# EAGLE design controller_rev4.2b (EAGLE 9.3.0)

## Sheet 1 of 3: Controller
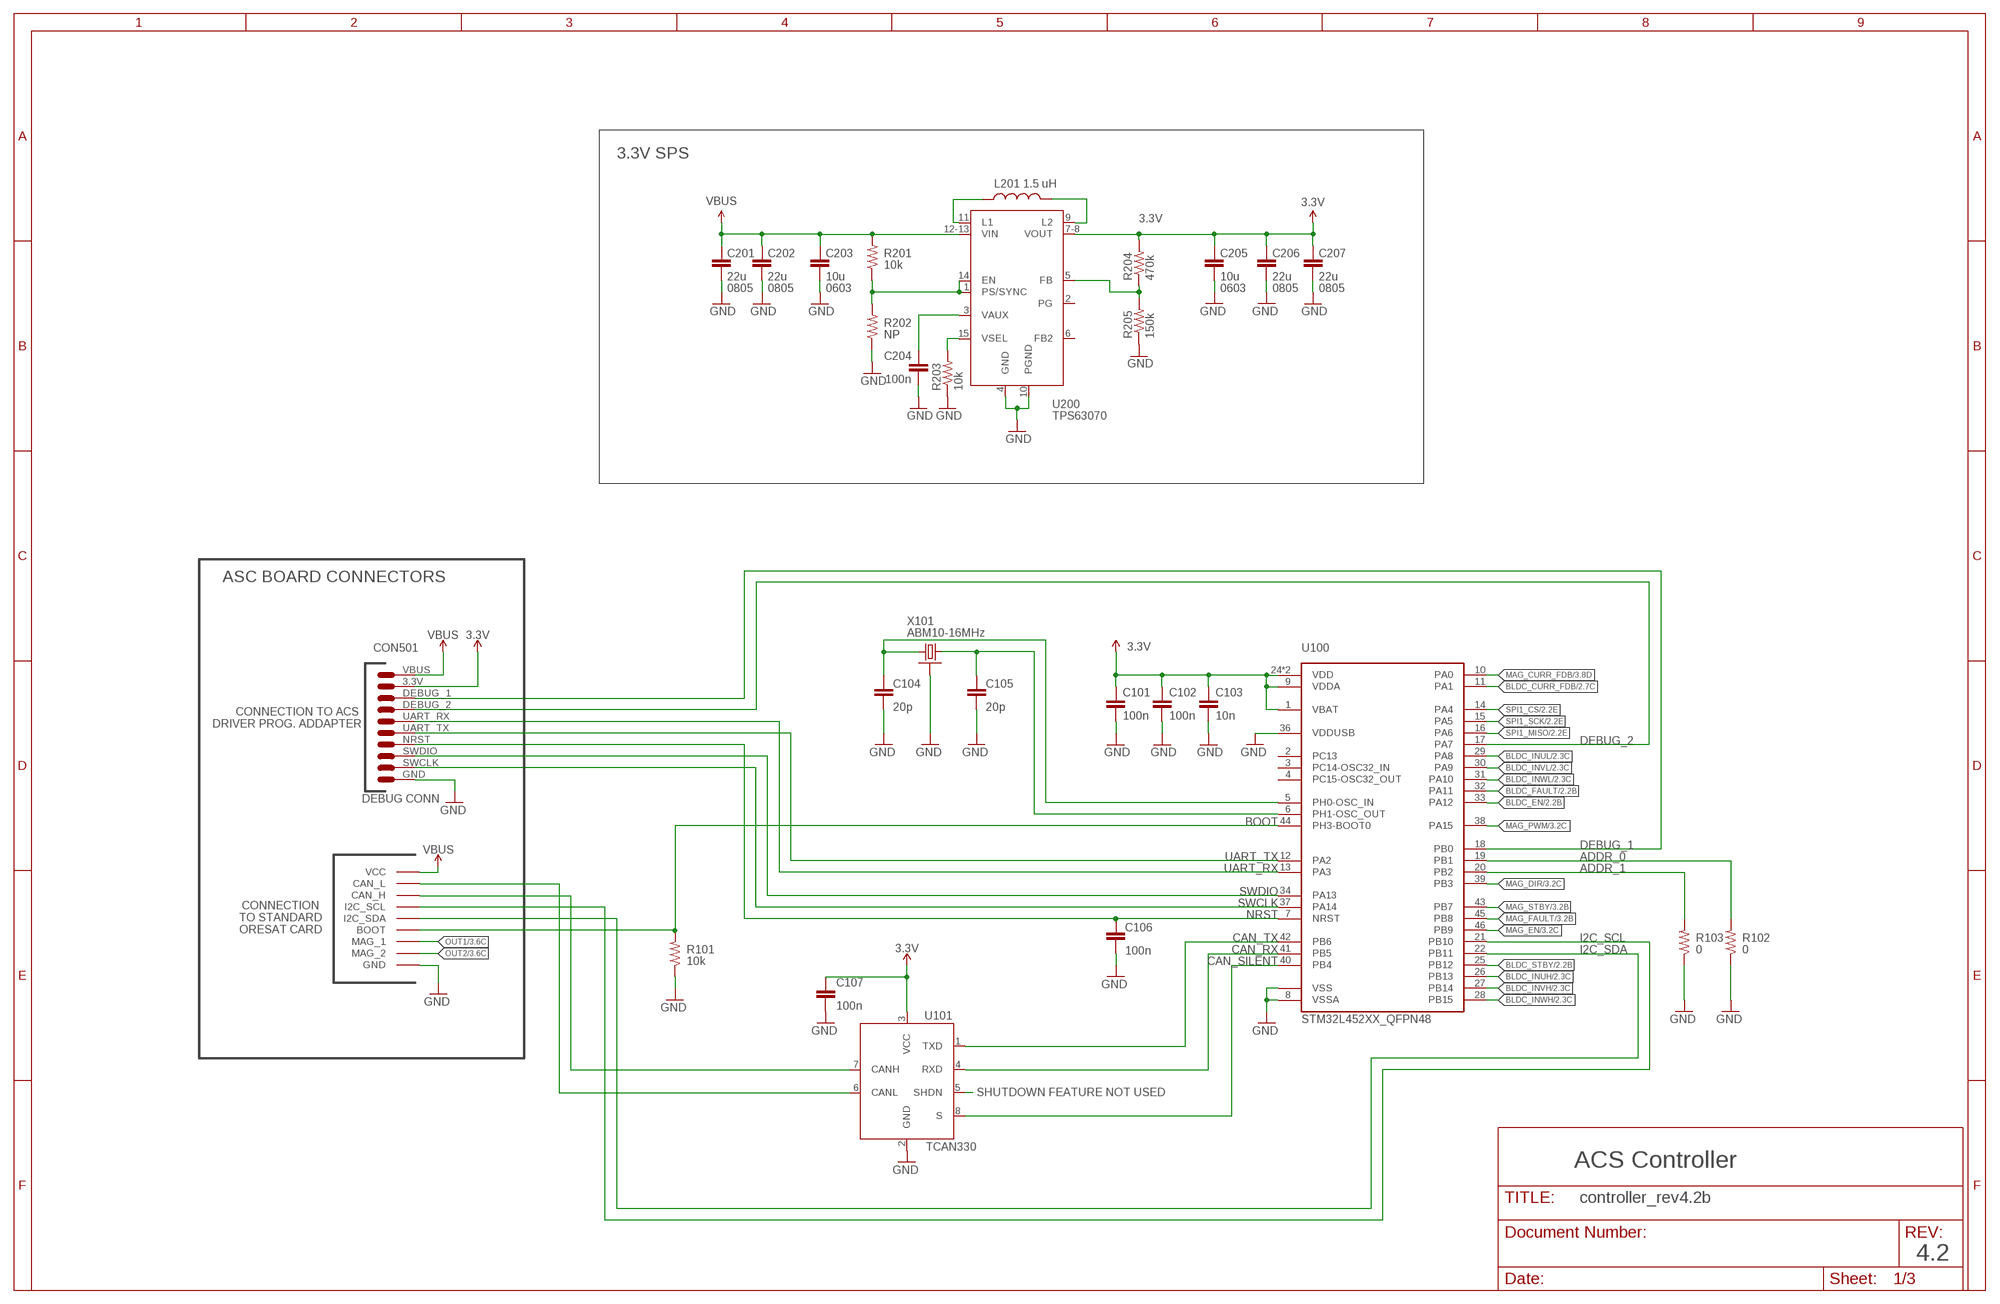
[diagram p0: schematic, sheet 1]

### Parts
C101  100n  C-EU0402-B-NOSILK  [.0402-B-NOSILK]
C102  100n  C-EU0402-B-NOSILK  [.0402-B-NOSILK]
C103  10n  C-EU0402-B-NOSILK  [.0402-B-NOSILK]
C104  20p  C-EU0402-B-NOSILK  [.0402-B-NOSILK]
C105  20p  C-EU0402-B-NOSILK  [.0402-B-NOSILK]
C106  100n  C-EU0402-B-NOSILK  [.0402-B-NOSILK]
C107  100n  C-EU0402-B-NOSILK  [.0402-B-NOSILK]
C201  22u  C-EU0805-B-NOSILK  [.0805-B-NOSILK]
C202  22u  C-EU0805-B-NOSILK  [.0805-B-NOSILK]
C203  10u  C-EU0603-B-NOSILK  [.0603-B-NOSILK]
C204  100n  C-EU0402-B-NOSILK  [.0402-B-NOSILK]
C205  10u  C-EU0603-B-NOSILK  [.0603-B-NOSILK]
C206  22u  C-EU0805-B-NOSILK  [.0805-B-NOSILK]
C207  22u  C-EU0805-B-NOSILK  [.0805-B-NOSILK]
C501  DEBUG_CON  [DEBUG_CON]
L201  1.5 uH  L-COILCRAFT-XFL4020  [L-COILCRAFT-XFL4020]
R101  10k  R-US_0402-B-NOSILK  [.0402-B-NOSILK]
R102  0  R-US_0402-B-NOSILK  [.0402-B-NOSILK]
R103  0  R-US_0402-B-NOSILK  [.0402-B-NOSILK]
R201  10k  R-US_0402-B-NOSILK  [.0402-B-NOSILK]
R202  NP  R-US_0402-B-NOSILK  [.0402-B-NOSILK]
R203  10k  R-US_0402-B-NOSILK  [.0402-B-NOSILK]
R204  470k  R-US_0402-B-NOSILK  [.0402-B-NOSILK]
R205  150k  R-US_0402-B-NOSILK  [.0402-B-NOSILK]
U100  STM32L452XX_QFPN48  [QFPN-48]
U101  TCAN330  [SOT23-8_TI-DCN]
U200  TPS63070  TPS63070X  [TPS63070X]
U$2  MEZZANINE_1  [MEZZANINE_1]
X101  ABM10-16MHz  CRYSTAL-WITH-GND  [CRYSTAL_2.5X2]

### Nets
3.3V: C101.1 C102.1 C103.1 C107.1 C205.1 C206.1 C207.1 C501.3.3V R204.2 U100.1(VBAT) U100.9(VDDA) U100.24(VDD) U100.48(VDD) U101.3(VCC) U200.7-8(VOUT) ; also sheet 2,3
ADDR_0: R102.2 U100.19(PB1)
ADDR_1: R103.2 U100.20(PB2)
BLDC_CURR_FDB: U100.11(PA1) ; also sheet 2
BLDC_EN: U100.33(PA12) ; also sheet 2
BLDC_FAULT: U100.32(PA11) ; also sheet 2
BLDC_INUH: U100.26(PB13) ; also sheet 2
BLDC_INUL: U100.29(PA8) ; also sheet 2
BLDC_INVH: U100.27(PB14) ; also sheet 2
BLDC_INVL: U100.30(PA9) ; also sheet 2
BLDC_INWH: U100.28(PB15) ; also sheet 2
BLDC_INWL: U100.31(PA10) ; also sheet 2
BLDC_STBY: U100.25(PB12) ; also sheet 2
BOOT: R101.2 U100.44(PH3-BOOT0) U$2.P$9(BOOT) U$2.P$22(BOOT)
CAN_H: U101.7(CANH) U$2.P$6(CAN_H) U$2.P$25(CAN_H)
CAN_L: U101.6(CANL) U$2.P$5(CAN_L) U$2.P$26(CAN_L)
CAN_RX: U100.41(PB5) U101.4(RXD)
CAN_SHDN: U101.5(SHDN)
CAN_SILENT: U100.40(PB4) U101.8(S)
CAN_TX: U100.42(PB6) U101.1(TXD)
CLK1: C104.1 U100.5(PH0-OSC_IN) X101.3
CLK2: C105.1 U100.6(PH1-OSC_OUT) X101.1
DEBUG_1: C501.DEBUG_1 U100.18(PB0)
DEBUG_2: C501.DEBUG_2 U100.17(PA7)
GND: C101.2 C102.2 C103.2 C104.2 C105.2 C106.2 C107.2 C201.2 C202.2 C203.2 C204.2 C205.2 C206.2 C207.2 C501.GND R101.1 R102.1 R103.1 R202.1 R203.1 R205.1 U100.8(VSSA) U100.23(VSS) U100.35(VSS) U100.36(VDDUSB) U100.47(VSS) U100.EPAD(VSS) U101.2(GND) U200.4(GND) U200.10(PGND) U$2.P$1(GND) U$2.P$2(GND) U$2.P$14(GND) U$2.P$15(GND) U$2.P$16(GND) U$2.P$17(GND) U$2.P$29(GND) U$2.P$30(GND) X101.2(SHIELD) X101.4(SHIELD) ; also sheet 2,3
I2C_SCL: U100.21(PB10) U$2.P$7(I2C_SCL) U$2.P$24(I2C_SCL)
I2C_SDA: U100.22(PB11) U$2.P$8(I2C_SDA) U$2.P$23(I2C_SDA)
MAG_CURR_FDB: U100.10(PA0) ; also sheet 3
MAG_DIR: U100.39(PB3) ; also sheet 3
MAG_EN: U100.46(PB9) ; also sheet 3
MAG_FAULT: U100.45(PB8) ; also sheet 3
MAG_PWM: U100.38(PA15) ; also sheet 3
MAG_STBY: U100.43(PB7) ; also sheet 3
NRST: C106.1 C501.NRST U100.7(NRST)
OUT1: U$2.P$10(MAG_1) U$2.P$21(MAG_1) ; also sheet 3
OUT2: U$2.P$11(MAG_2) U$2.P$20(MAG_2) ; also sheet 3
SPI1_CS: U100.14(PA4) ; also sheet 2
SPI1_MISO: U100.16(PA6) ; also sheet 2
SPI1_SCK: U100.15(PA5) ; also sheet 2
SWCLK: C501.SWCLK U100.37(PA14)
SWDIO: C501.SWDIO U100.34(PA13)
TPS-EN2: R201.1 R202.2 U200.1(PS/SYNC) U200.14(EN)
TPS-FB2: R204.1 R205.2 U200.5(FB)
TPS-L5: L201.1 U200.11(L1)
TPS-L6: L201.2 U200.9(L2)
TPS-VAUX2: C204.1 U200.3(VAUX)
TPS-VSEL2: R203.2 U200.15(VSEL)
UART_RX: C501.UART_RX U100.13(PA3)
UART_TX: C501.UART_TX U100.12(PA2)
VBUS: C201.1 C202.1 C203.1 C501.VBUS R201.2 U200.12-13(VIN) U$2.P$3(VCC) U$2.P$4(VCC) U$2.P$12(VCC) U$2.P$13(VCC) U$2.P$18(VCC) U$2.P$19(VCC) U$2.P$27(VCC) U$2.P$28(VCC) ; also sheet 2,3
Unconnected: U100.2(PC13) U100.3(PC14-OSC32_IN) U100.4(PC15-OSC32_OUT) U200.2(PG) U200.6(FB2)

### Notes on the sheet
- 3.3V SPS
- 0805 | 0805 | 0603 | 0603 | 0805 | 0805
- ASC BOARD CONNECTORS
- CON501
- CONNECTION TO ACS 
  DRIVER PROG. ADDAPTER
- DEBUG CONN
- CONNECTION 
  TO STANDARD
  ORESAT CARD
- SHUTDOWN FEATURE NOT USED
- ACS Controller
- 4.2

## Sheet 2 of 3: Reaction Wheel
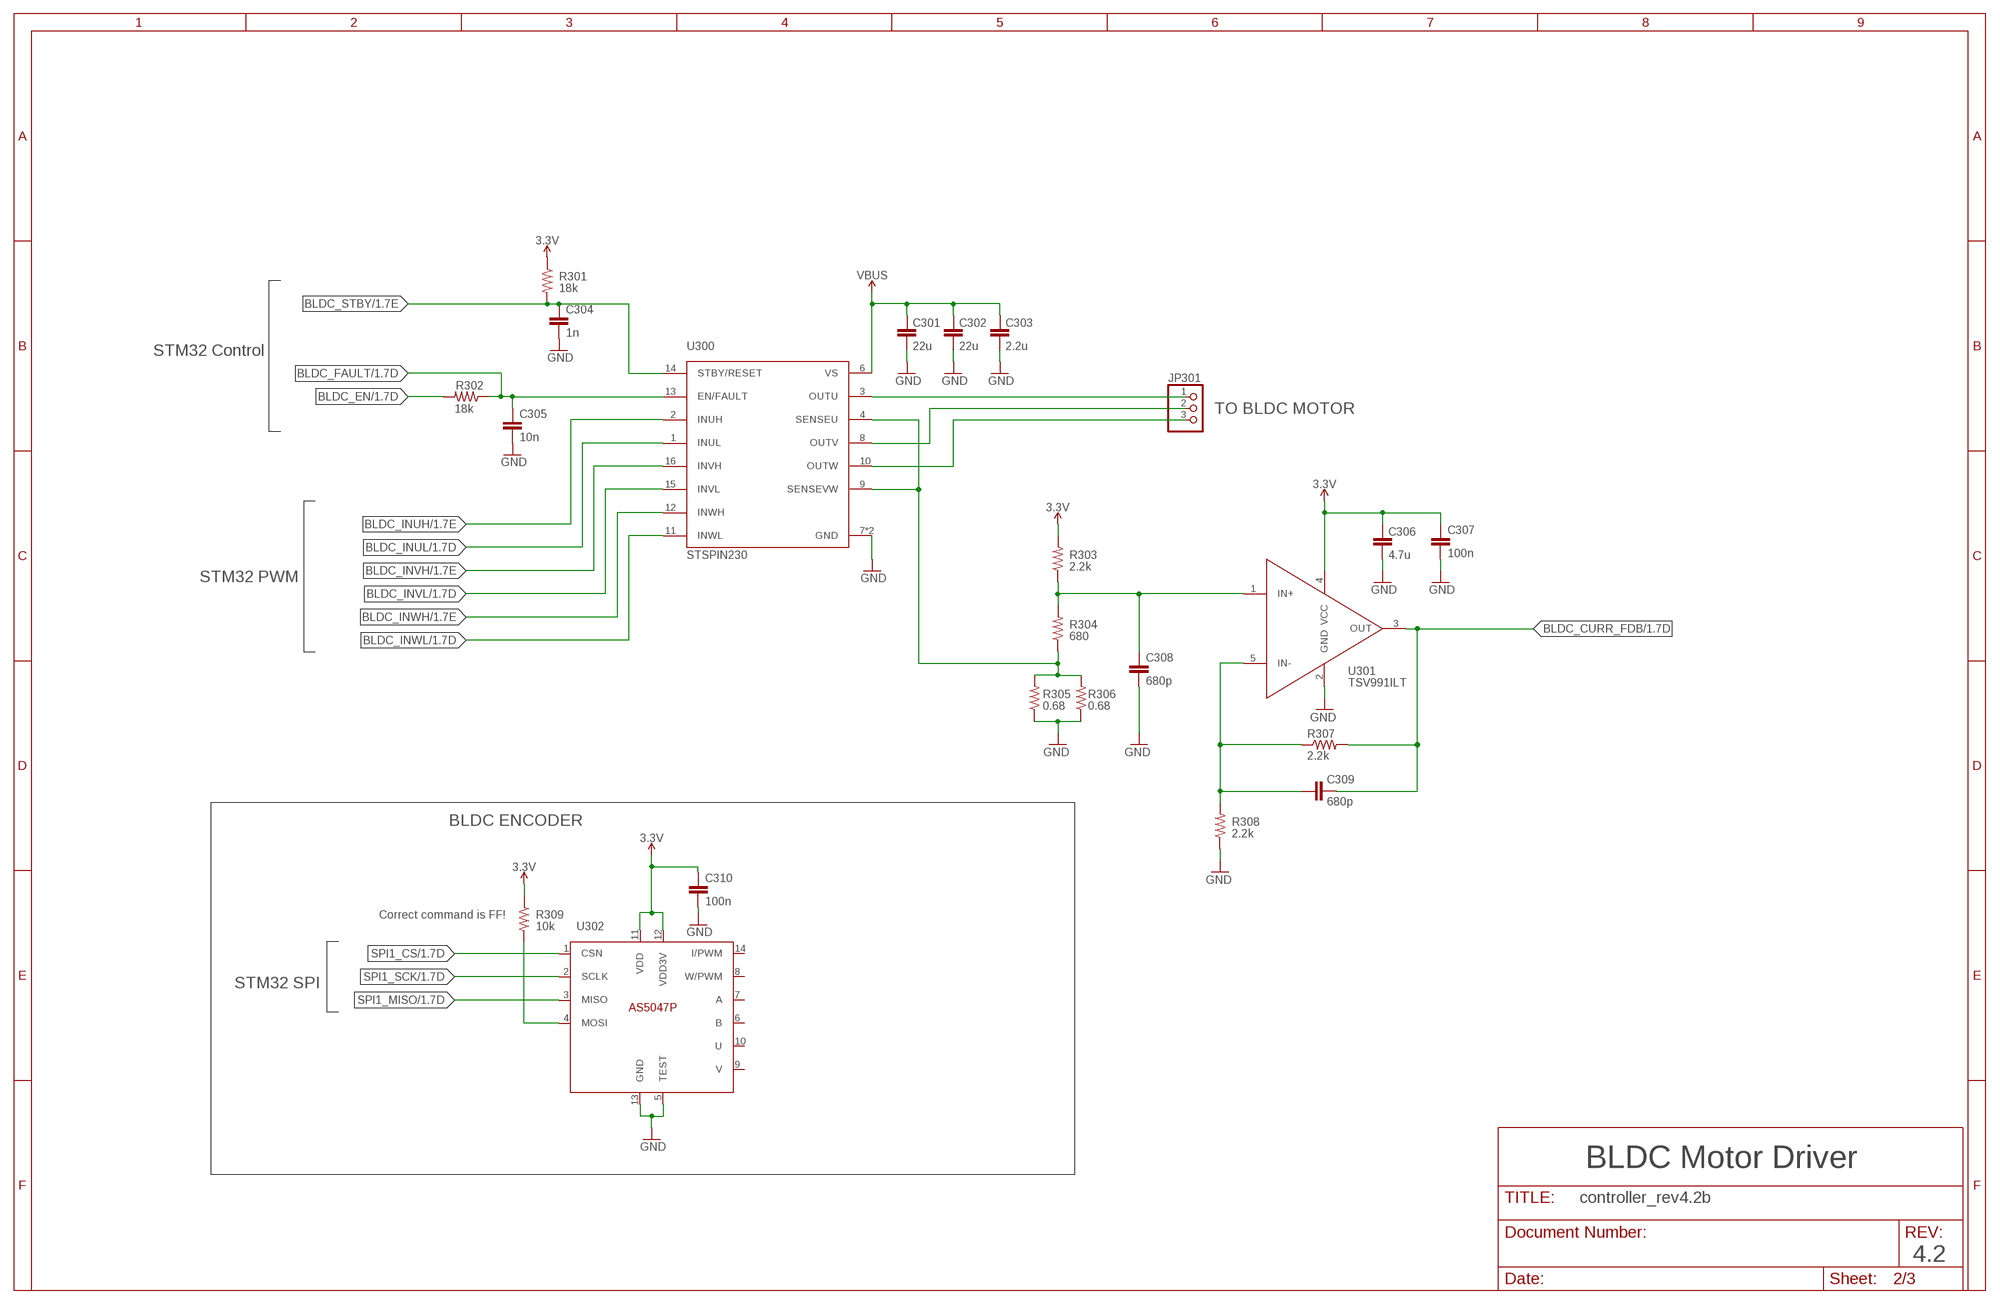
[diagram p1: schematic, sheet 2]

### Parts
C301  22u  C-EU0603-B-NOSILK  [.0603-B-NOSILK]
C302  22u  C-EU0603-B-NOSILK  [.0603-B-NOSILK]
C303  2.2u  C-EU0603-B-NOSILK  [.0603-B-NOSILK]
C304  1n  C-EU0402-B-NOSILK  [.0402-B-NOSILK]
C305  10n  C-EU0402-B-NOSILK  [.0402-B-NOSILK]
C306  4.7u  C-EU0603-B-NOSILK  [.0603-B-NOSILK]
C307  100n  C-EU0402-B-NOSILK  [.0402-B-NOSILK]
C308  680p  C-EU0402-B-NOSILK  [.0402-B-NOSILK]
C309  680p  C-EU0402-B-NOSILK  [.0402-B-NOSILK]
C310  100n  C-EU0402-B-NOSILK  [.0402-B-NOSILK]
JP301  PINHD-1X03_2.00  [1X03M]
R301  18k  R-US_0402-B-NOSILK  [.0402-B-NOSILK]
R302  18k  R-US_0402-B-NOSILK  [.0402-B-NOSILK]
R303  2.2k  R-US_0402-B-NOSILK  [.0402-B-NOSILK]
R304  680  R-US_0402-B-NOSILK  [.0402-B-NOSILK]
R305  0.68  R-US_0805-B-NOSILK  [.0805-B-NOSILK]
R306  0.68  R-US_0805-B-NOSILK  [.0805-B-NOSILK]
R307  2.2k  R-US_0402-B-NOSILK  [.0402-B-NOSILK]
R308  2.2k  R-US_0402-B-NOSILK  [.0402-B-NOSILK]
R309  10k  R-US_0402-B-NOSILK  [.0402-B-NOSILK]
U300  STSPIN230  [VFQPN]
U301  TSV991ILT  [SOT23-5]
U302  AS5047P  [TSSOP14]

### Nets
3.3V: C306.1 C307.1 C310.1 R301.1 R303.2 R309.1 U301.4(VCC) U302.11(VDD) U302.12(VDD3V) ; also sheet 1,3
AS5047_MOSI: R309.2 U302.4(MOSI)
B_IN+: C308.1 R303.1 R304.2 U301.1(IN+)
B_IN-: C309.2 R307.1 R308.2 U301.5(IN-)
BLDC_CURR_FDB: C309.1 R307.2 U301.3(OUT) ; also sheet 1
BLDC_EN: R302.2 ; also sheet 1
BLDC_FAULT: C305.1 R302.1 U300.13(EN/FAULT) ; also sheet 1
BLDC_INUH: U300.2(INUH) ; also sheet 1
BLDC_INUL: U300.1(INUL) ; also sheet 1
BLDC_INVH: U300.16(INVH) ; also sheet 1
BLDC_INVL: U300.15(INVL) ; also sheet 1
BLDC_INWH: U300.12(INWH) ; also sheet 1
BLDC_INWL: U300.11(INWL) ; also sheet 1
BLDC_STBY: C304.1 R301.2 U300.14(STBY/RESET) ; also sheet 1
GND: C301.2 C302.2 C303.2 C304.2 C305.2 C306.2 C307.2 C308.2 C310.2 R305.1 R306.1 R308.1 U300.7(GND) U300.EPAD(GND) U301.2(GND) U302.5(TEST) U302.13(GND) ; also sheet 1,3
SENSE_BLDC: R304.1 R305.2 R306.2 U300.4(SENSEU) U300.9(SENSEVW)
SPI1_CS: U302.1(CSN) ; also sheet 1
SPI1_MISO: U302.3(MISO) ; also sheet 1
SPI1_SCK: U302.2(SCLK) ; also sheet 1
U: JP301.1 U300.3(OUTU)
V: JP301.2 U300.8(OUTV)
VBUS: C301.1 C302.1 C303.1 U300.6(VS) ; also sheet 1,3
W: JP301.3 U300.10(OUTW)
Unconnected: U302.6(B) U302.7(A) U302.8(W/PWM) U302.9(V) U302.10(U) U302.14(I/PWM)

### Notes on the sheet
- STM32 Control
- TO BLDC MOTOR
- STM32 PWM
- BLDC ENCODER
- Correct command is FF!
- STM32 SPI
- BLDC Motor Driver
- 4.2

## Sheet 3 of 3: Magnetorquer
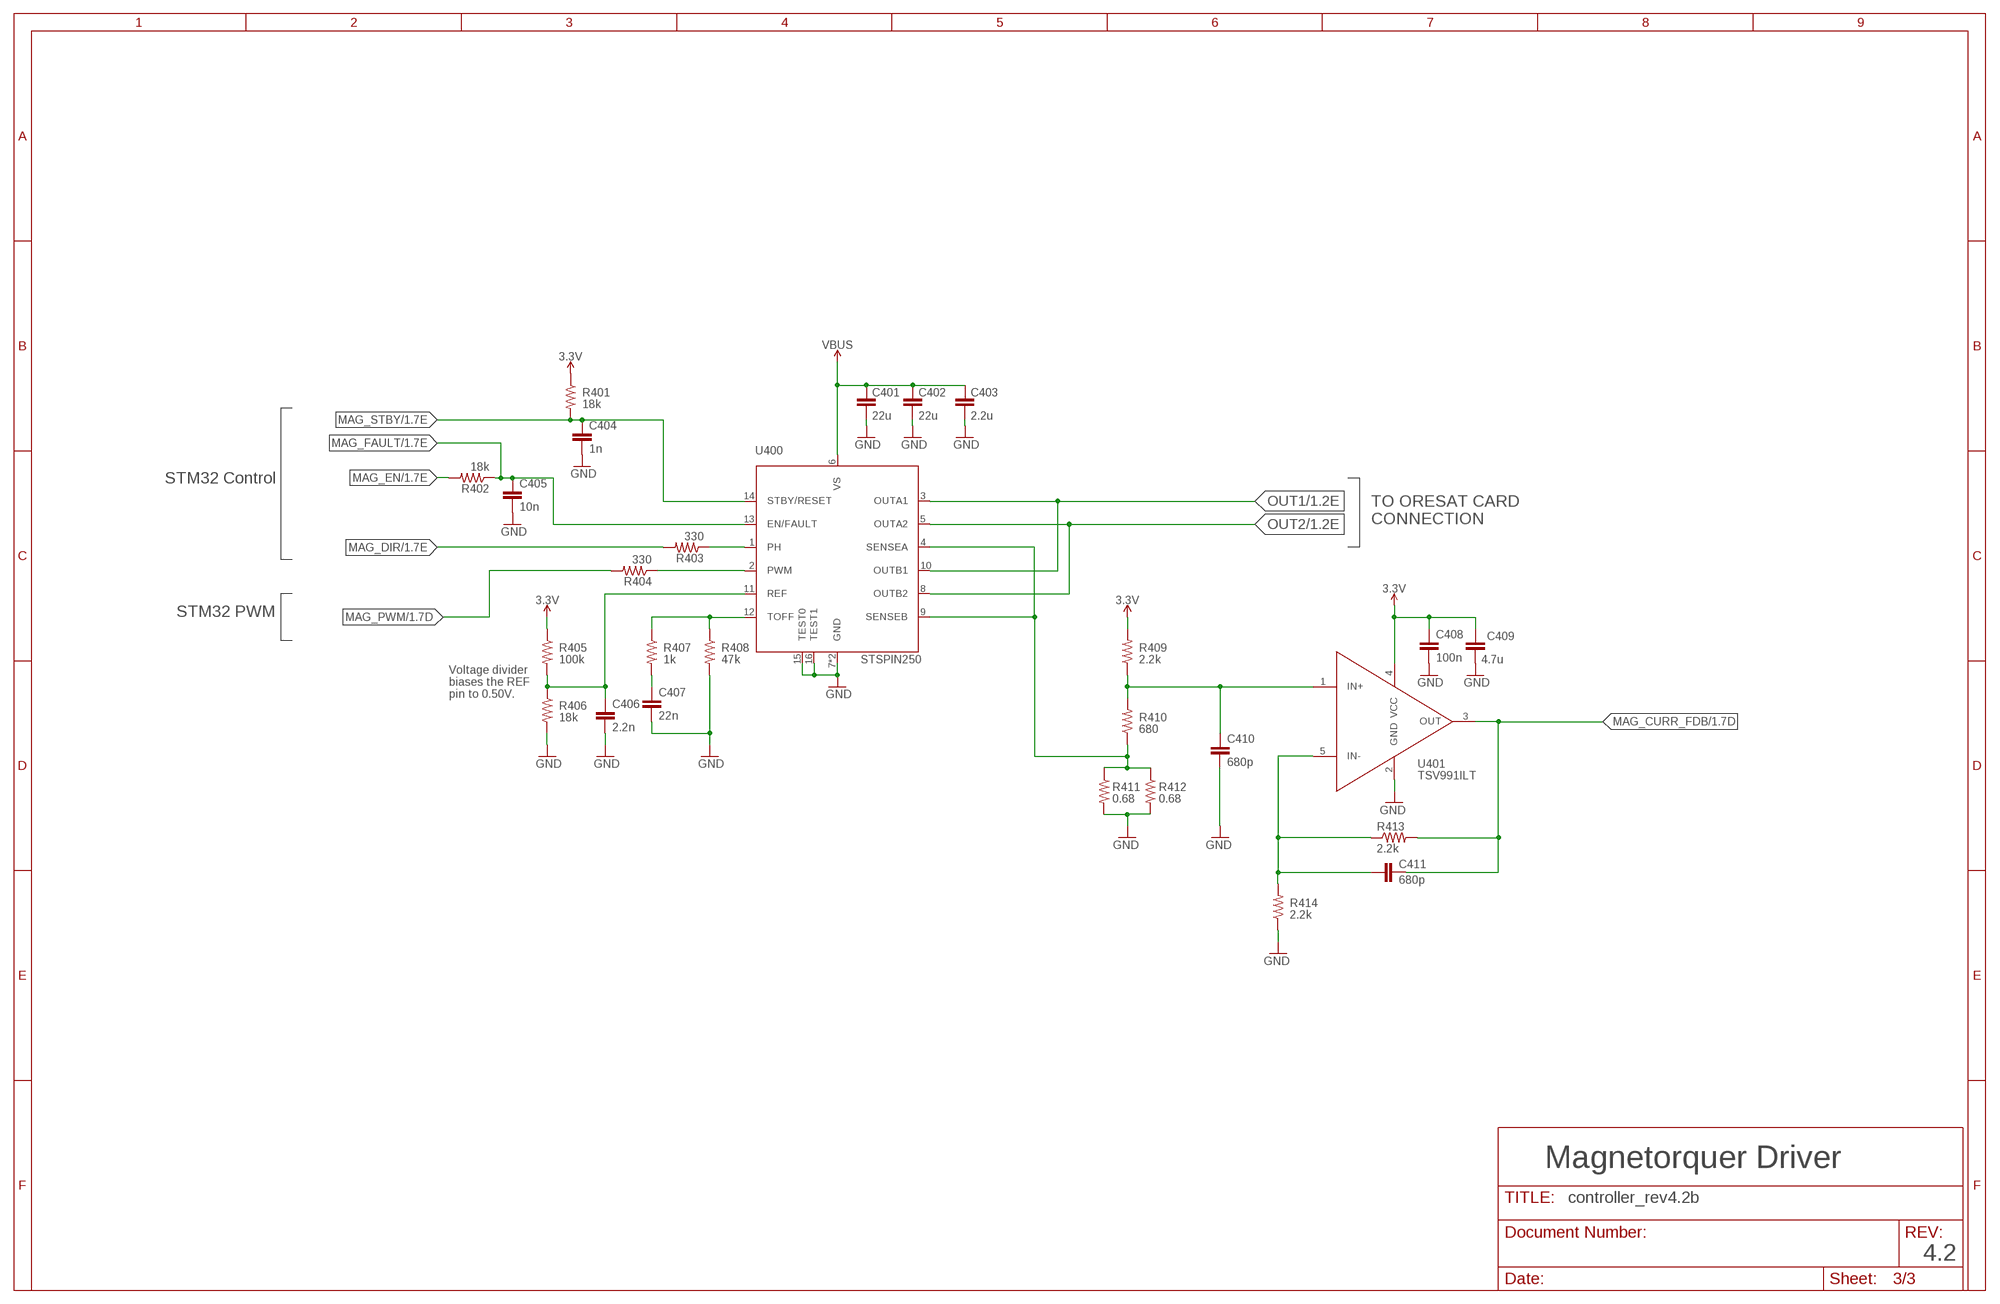
[diagram p2: schematic, sheet 3]

### Parts
C401  22u  C-EU0603-B-NOSILK  [.0603-B-NOSILK]
C402  22u  C-EU0603-B-NOSILK  [.0603-B-NOSILK]
C403  2.2u  C-EU0603-B-NOSILK  [.0603-B-NOSILK]
C404  1n  C-EU0402-B-NOSILK  [.0402-B-NOSILK]
C405  10n  C-EU0402-B-NOSILK  [.0402-B-NOSILK]
C406  2.2n  C-EU0402-B-NOSILK  [.0402-B-NOSILK]
C407  22n  C-EU0402-B-NOSILK  [.0402-B-NOSILK]
C408  100n  C-EU0402-B-NOSILK  [.0402-B-NOSILK]
C409  4.7u  C-EU0603-B-NOSILK  [.0603-B-NOSILK]
C410  680p  C-EU0402-B-NOSILK  [.0402-B-NOSILK]
C411  680p  C-EU0402-B-NOSILK  [.0402-B-NOSILK]
R401  18k  R-US_0402-B-NOSILK  [.0402-B-NOSILK]
R402  18k  R-US_0402-B-NOSILK  [.0402-B-NOSILK]
R403  330  R-US_0402-B-NOSILK  [.0402-B-NOSILK]
R404  330  R-US_0402-B-NOSILK  [.0402-B-NOSILK]
R405  100k  R-US_0402-B-NOSILK  [.0402-B-NOSILK]
R406  18k  R-US_0402-B-NOSILK  [.0402-B-NOSILK]
R407  1k  R-US_0402-B-NOSILK  [.0402-B-NOSILK]
R408  47k  R-US_0402-B-NOSILK  [.0402-B-NOSILK]
R409  2.2k  R-US_0402-B-NOSILK  [.0402-B-NOSILK]
R410  680  R-US_0402-B-NOSILK  [.0402-B-NOSILK]
R411  0.68  R-US_0805-B-NOSILK  [.0805-B-NOSILK]
R412  0.68  R-US_0805-B-NOSILK  [.0805-B-NOSILK]
R413  2.2k  R-US_0402-B-NOSILK  [.0402-B-NOSILK]
R414  2.2k  R-US_0402-B-NOSILK  [.0402-B-NOSILK]
U400  STSPIN250  [VFQPN]
U401  TSV991ILT  [SOT23-5]

### Nets
3.3V: C408.1 C409.1 R401.1 R405.1 R409.2 U401.4(VCC) ; also sheet 1,2
250_REF: C406.1 R405.2 R406.1 U400.11(REF)
250_TOFF: R407.1 R408.1 U400.12(TOFF)
GND: C401.2 C402.2 C403.2 C404.2 C405.2 C406.2 C407.2 C408.2 C409.2 C410.2 R406.2 R408.2 R411.2 R412.2 R414.1 U400.7(GND) U400.15(TEST0) U400.16(TEST1) U400.EPAD(GND) U401.2(GND) ; also sheet 1,2
M_IN+: C410.1 R409.1 R410.2 U401.1(IN+)
M_IN-: C411.2 R413.1 R414.2 U401.5(IN-)
M_PH: R403.1 U400.1(PH)
M_PWM: R404.1 U400.2(PWM)
MAG_CURR_FDB: C411.1 R413.2 U401.3(OUT) ; also sheet 1
MAG_DIR: R403.2 ; also sheet 1
MAG_EN: R402.2 ; also sheet 1
MAG_FAULT: C405.1 R402.1 U400.13(EN/FAULT) ; also sheet 1
MAG_PWM: R404.2 ; also sheet 1
MAG_STBY: C404.1 R401.2 U400.14(STBY/RESET) ; also sheet 1
OUT1: U400.3(OUTA1) U400.10(OUTB1) ; also sheet 1
OUT2: U400.5(OUTA2) U400.8(OUTB2) ; also sheet 1
SENSE_MAG: R410.1 R411.1 R412.1 U400.4(SENSEA) U400.9(SENSEB)
TOFF1: C407.1 R407.2
VBUS: C401.1 C402.1 C403.1 U400.6(VS) ; also sheet 1,2

### Notes on the sheet
- STM32 Control
- TO ORESAT CARD 
  CONNECTION
- STM32 PWM
- Voltage divider
  biases the REF
  pin to 0.50V.
- Magnetorquer Driver
- 4.2

## Library data of the parts
C101-C103 C107 C204 C304 C305 C307-C310 C404-C408 C410 C411 = rcl_custom:C-EU: CAPACITOR, European symbol; DIS: Digi-Key; DPN: 1276-1001-1-ND; MFR: Samsung; MPN: CL05B104KO5NNNC
C104-C106 = rcl_custom:C-EU: CAPACITOR, European symbol; DIS: Digi-Key; DPN: 1276-6601-1-ND; MFR: Samsung; MPN: CL05C200JB51PNC
C201 C202 C206 C207 = oresat-rcl:C-EU: CAPACITOR, European symbol
C203 C205 C301-C303 C306 C401-C403 C409 = oresat-rcl:C-EU: CAPACITOR, European symbol; DIS: Digi-Key; DPN: 1276-1001-1-ND; MFR: Samsung; MPN: CL05B104KO5NNNC
C501 = oresat-ACS_driver_board:DEBUG_CON
JP301 = pinhead-2:PINHD-1X03: PIN HEADER
L201 = L-Coilcraft-XFL4020:L-COILCRAFT-XFL4020; DIS: Mouser; DPN: 994-XFL4020-152MEB; MFR: Coilcraft; MPN: XFL4020-152ME
R101-R103 R201-R205 R301-R304 R307-R309 R401-R410 R413 R414 = rcl_custom:R-US_: RESISTOR, American symbol; DIS: Digi-Key; DPN: 1276-4275-1-ND; MFR: Samsung; MPN: RC1005F6653CS
R305 R306 R411 R412 = oresat-rcl:R-US_: RESISTOR, American symbol
U100 = oresat-ACS_driver_board:STM32L452XX_QFPN48
U101 = TCAN330:TCAN330; DIS: Digi-Key; DPN: 296-44211-1-ND; MFR: Texas Instruments; MPN: TCAN330GDCNT
U200 = ic-pwr-tps63070x:TPS63070X: TPS63070 2-V to 16-V Buck-Boost Converter With 3.6-A Switch Current; DIS: Digi-Key; DPN: 296-44874-1-ND; MFR: TI; MPN: TPS63070
U300 = oresat-ACS_driver_board:STSPIN230
U301 U401 = oresat-ACS_driver_board:TSV991ILT
U302 = U-AMS-AS5047P-encoder:AS5047P
U400 = oresat-ACS_driver_board:STSPIN250
U$2 = oresat-ACS_driver_board:MEZZANINE_1
X101 = low-gain-radio:CRYSTAL-WITH-GND; DIS: Digi-Key; DPN: XC2181CT-ND; MFR: ECS Inc.; MPN: ECS-160-10-36Q-ES-TR

## Board
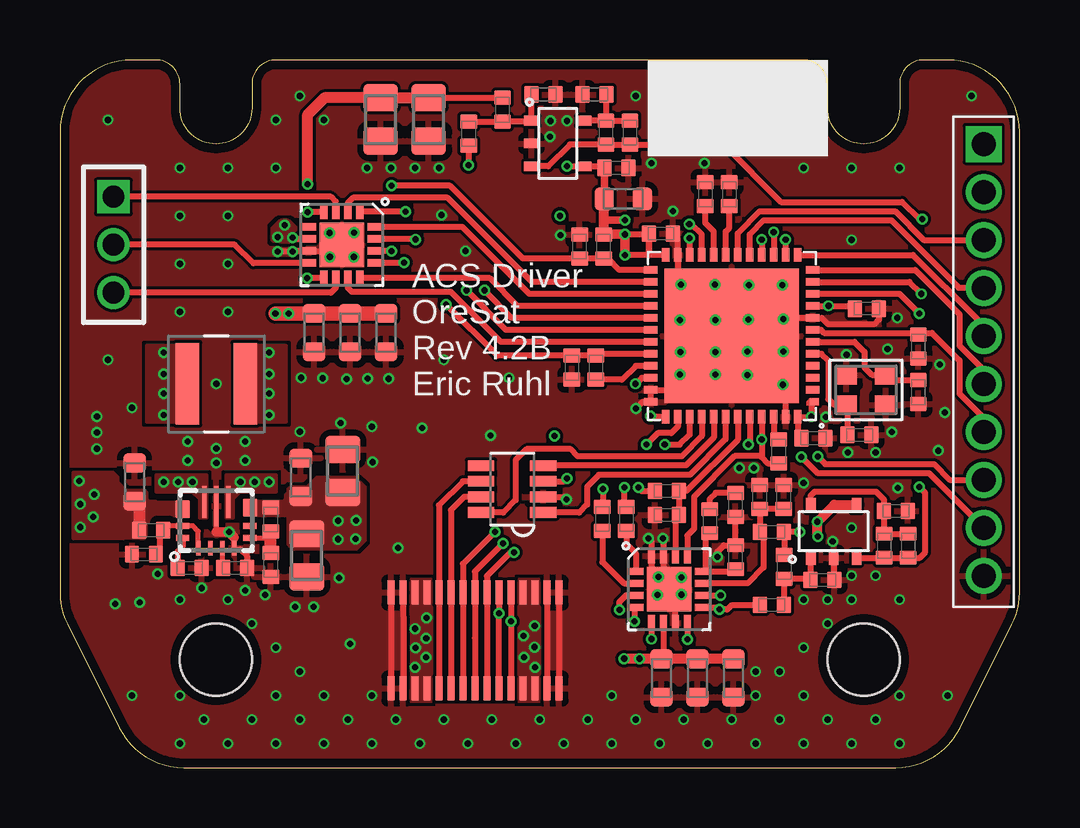
[diagram p3: board, top side]
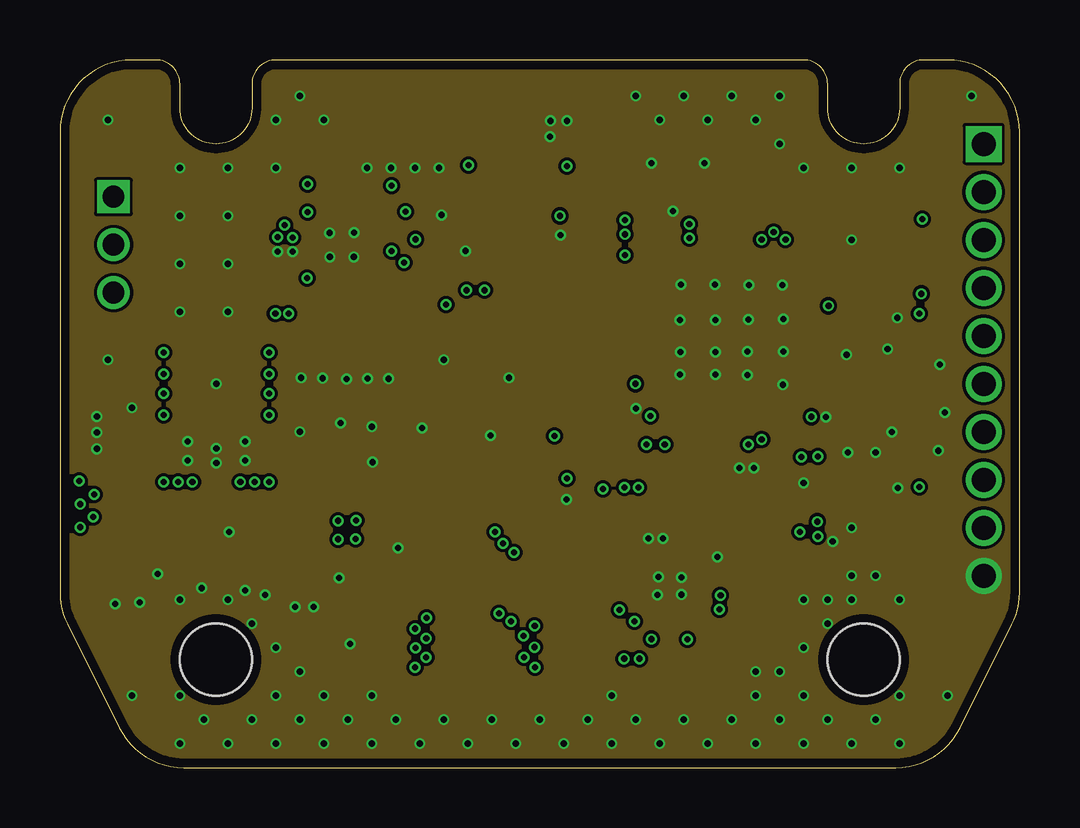
[diagram p4: board, inner layer Route2]
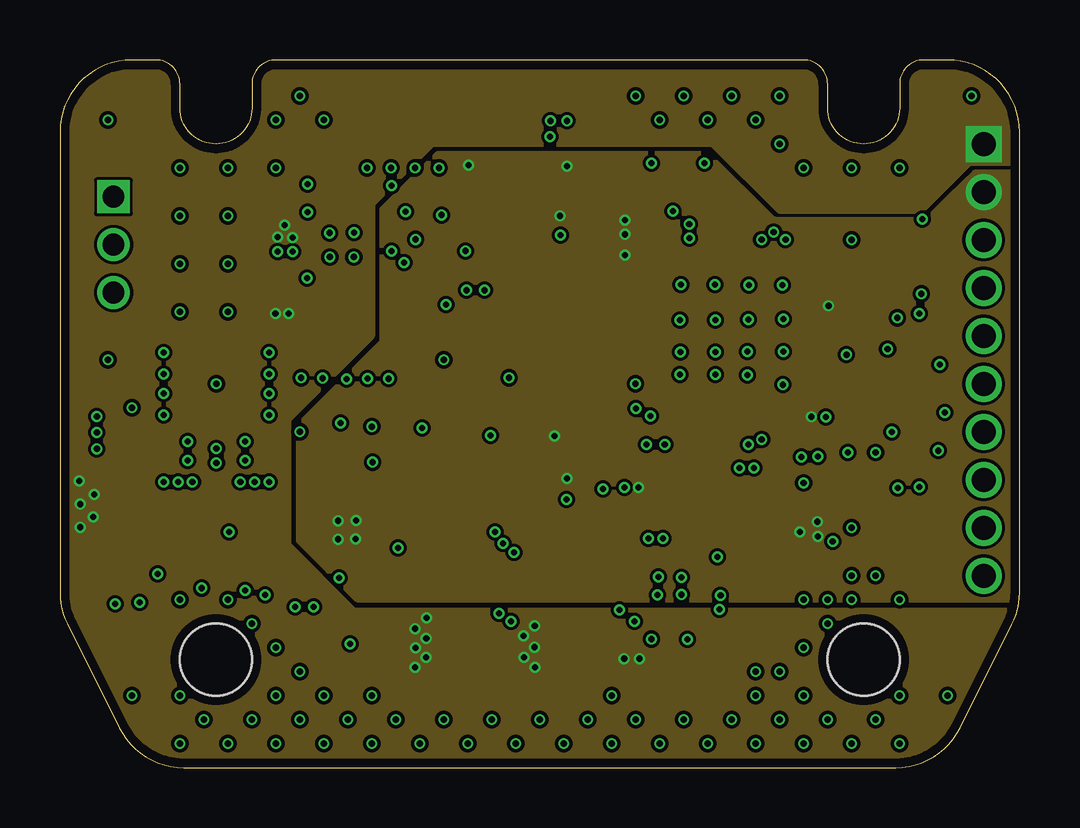
[diagram p5: board, inner layer Route15]
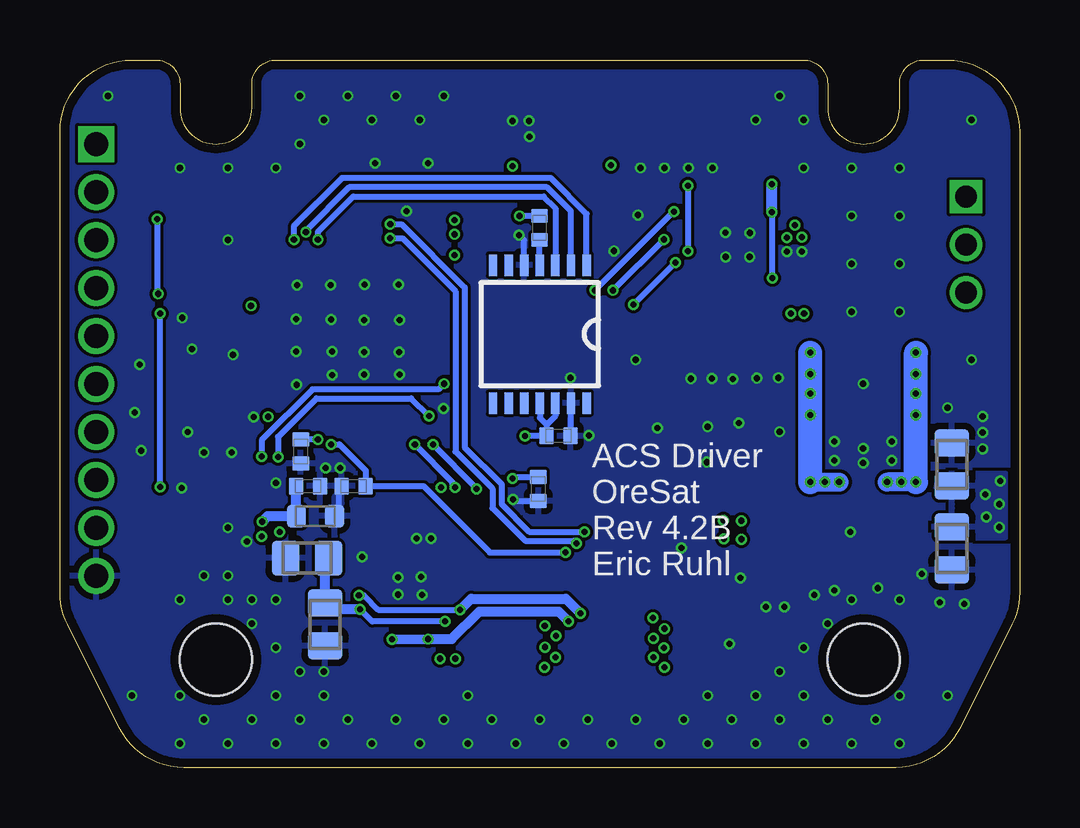
[diagram p6: board, bottom side, seen from below]

Size 40 x 29.5 mm. Coordinates in mm from the lower left corner, seen from the top.
Outline: 0,26.5 0,7.31 arc27 0.32,5.97 2.47,1.66 arc63 5.15,0 34.85,0 arc63 37.53,1.66 39.68,5.97 arc27 40,7.31 40,26.5 arc90 37,29.5 36,29.5 arc90 35,28.5 35,27.5 arc-90 33.5,26 arc-90 32,27.5 32,28.5 arc90 31,29.5 9,29.5 arc90 8,28.5 8,27.5 arc-90 6.5,26 arc-90 5,27.5 5,28.5 arc90 4,29.5 3,29.5 arc90 0,26.5
Copper layers (1*2*15*16): Top 0.035559375mm / dielectric 0.17018125mm / Route2 0.01778125mm / dielectric 47mil / Route15 0.01778125mm / dielectric 0.17018125mm / Bottom 0.035559375mm
Design rules "Osh park 4 layer *": minimum track width 5mil, minimum drill 10mil, track to track 5mil, track to pad 5mil, pad to pad 5mil, via to via 5mil, smd to smd 5mil, copper to edge 15mil, drill to drill 6mil, minimum pad ring 4mil, minimum via ring 4mil, stop-mask expansion 2.5mil, vias tented up to drill 11mil, thermal gap 10mil
Holes 3 mm at 6.5,4.5 33.5,4.5
tKeepout: area 4,25 to 9,30; area 4,2 to 9,7; area 31,2 to 36,7; area 31,25 to 36,30

### Footprints (pad centres in the part's own frame; a part is rotated, then mirrored left to right if it is on the bottom)
.0402-B-NOSILK = smd 0.6 x 0.7: 1 -0.5,0; 2 0.5,0
.0805-B-NOSILK = smd 1.15 x 1.45: 1 -0.9,0; 2 0.9,0
.0603-B-NOSILK = smd 0.8 x 0.95: 1 -0.8,0; 2 0.8,0
DEBUG_CON = drill 1: 3.3V 0,6; DEBUG_1 0,4; DEBUG_2 0,2; GND 0,-10; NRST 0,-4; SWCLK 0,-8; SWDIO 0,-6; UART_RX 0,0; UART_TX 0,-2 | drill 1 square: VBUS 0,8
1X03M = drill 0.914 square: 1 -2,0 | drill 0.914: 2 0,0; 3 2,0
L-COILCRAFT-XFL4020 = smd 0.98 x 3.4: 1 -1.2,0; 2 1.2,0
QFPN-48 = smd 0.38 x 0.28: 1 -3.45,2.75 | smd 0.55 x 0.3: 2 -3.375,2.25; 3 -3.375,1.75; 4 -3.375,1.25; 5 -3.375,0.75; 6 -3.375,0.25; 7 -3.375,-0.25; 8 -3.375,-0.75; 9 -3.375,-1.25; 10 -3.375,-1.75; 11 -3.375,-2.25; 12 -3.375,-2.75; 25 3.375,-2.75; 26 3.375,-2.25; 27 3.375,-1.75; 28 3.375,-1.25; 29 3.375,-0.75; 30 3.375,-0.25; 31 3.375,0.25; 32 3.375,0.75; 33 3.375,1.25; 34 3.375,1.75; 35 3.375,2.25; 36 3.375,2.75 | smd 0.3 x 0.55: 13 -2.75,-3.375; 14 -2.25,-3.375; 15 -1.75,-3.375; 16 -1.25,-3.375; 17 -0.75,-3.375; 18 -0.25,-3.375; 19 0.25,-3.375; 20 0.75,-3.375; 21 1.25,-3.375; 22 1.75,-3.375; 23 2.25,-3.375; 24 2.75,-3.375; 37 2.75,3.375; 38 2.25,3.375; 39 1.75,3.375; 40 1.25,3.375; 41 0.75,3.375; 42 0.25,3.375; 43 -0.25,3.375; 44 -0.75,3.375; 45 -1.25,3.375; 46 -1.75,3.375; 47 -2.25,3.375; 48 -2.75,3.375 | smd 5.6 x 5.6: EPAD 0,0
SOT23-8_TI-DCN = smd 0.45 x 1.1: 1 -0.975,-1.3; 2 -0.325,-1.3; 3 0.325,-1.3; 4 0.975,-1.3; 5 0.975,1.3; 6 0.325,1.3; 7 -0.325,1.3; 8 -0.975,1.3
TPS63070X = smd 0.6 x 0.25: 1 -1.15,0.75; 2 -1.15,0.25; 3 -1.15,-0.25; 4 -1.15,-0.75 | smd 0.25 x 0.6: 5 -0.725,-1.4; 6 -0.225,-1.4; 14 -0.225,1.4; 15 -0.725,1.4 | smd 0.75 x 0.6: 7-8 0.525,-1.4; 12-13 0.475,1.4 | smd 1.35 x 0.25: 9 0.775,-0.5; 11 0.775,0.5 | smd 1.7 x 0.25: 10 0.6,0
VFQPN = smd 0.63 x 0.3: 1 -1.39,0.75; 2 -1.39,0.25; 3 -1.39,-0.25; 4 -1.39,-0.75; 9 1.39,-0.75; 10 1.39,-0.25; 11 1.39,0.25; 12 1.39,0.75 | smd 0.3 x 0.63: 5 -0.75,-1.39; 6 -0.25,-1.39; 7 0.25,-1.39; 8 0.75,-1.39; 13 0.75,1.39; 14 0.25,1.39; 15 -0.25,1.39; 16 -0.75,1.39 | smd 1.85 x 1.85: EPAD 0,0
SOT23-5 = smd 0.6 x 0.4: 1 -1.1,0.95; 2 -1.1,0; 3 -1.1,-0.95; 4 1.1,-0.95; 5 1.1,0.95
TSSOP14 = smd 0.9 x 0.35: 1 -2.875,1.95; 2 -2.875,1.3; 3 -2.875,0.65; 4 -2.875,0; 5 -2.875,-0.65; 6 -2.875,-1.3; 7 -2.875,-1.95; 8 2.875,-1.95; 9 2.875,-1.3; 10 2.875,-0.65; 11 2.875,0; 12 2.875,0.65; 13 2.875,1.3; 14 2.875,1.95
MEZZANINE_1 = smd 0.3 x 1: P$1 -3.5,2; P$2 -3,2; P$3 -2.5,2; P$4 -2,2; P$5 -1.5,2; P$6 -1,2; P$7 -0.5,2; P$8 0,2; P$9 0.5,2; P$10 1,2; P$11 1.5,2; P$12 2,2; P$13 2.5,2; P$14 3,2; P$15 3.5,2; P$16 3.5,-2; P$17 3,-2; P$18 2.5,-2; P$19 2,-2; P$20 1.5,-2; P$21 1,-2; P$22 0.5,-2; P$23 0,-2; P$24 -0.5,-2; P$25 -1,-2; P$26 -1.5,-2; P$27 -2,-2; P$28 -2.5,-2; P$29 -3,-2; P$30 -3.5,-2
CRYSTAL_2.5X2 = smd 0.9 x 0.8: 1 -0.825,-0.625; 2 0.825,-0.625; 3 0.825,0.625; 4 -0.825,0.625

### Placement (x,y rotation side)
C101  31.41,13.73 0 top
C102  25.05,22.26 0 top
C103  33.64,19.13 0 top
C104  33.33,13.87 0 top
C105  35.78,15.65 270 top
C106  35.78,17.55 270 top
C107  20.06,11.61 270 bottom
C201  2.82,12.64 90 bottom
C202  2.82,9.14 270 bottom
C203  3.11,11.9 90 top
C204  7.3,8.32 0 top
C205  10.04,12.1 90 top
C206  11.79,12.36 90 top
C207  10.29,8.85 270 top
C301  13.59,18.13 270 top
C302  12.09,18.13 270 top
C303  10.59,18.13 270 top
C304  21.66,21.72 90 top
C305  21.34,16.67 270 top
C306  23.48,23.71 0 top
C307  23.2,25 0 top
C308  20.15,28.06 0 top
C309  23.76,26.47 90 top
C310  19.22,13.83 0 bottom
C401  28.07,3.73 270 top
C402  26.57,3.73 270 top
C403  25.07,3.73 270 top
C404  25.3,10.53 180 top
C405  29.96,13.18 270 bottom
C406  29.17,11.28 90 top
C407  28.16,10.95 270 top
C408  29.66,11.73 0 bottom
C409  29.35,10.48 0 bottom
C410  31.79,7.82 0 top
C411  34.36,9.25 90 top
C501  38.5,18 0 top
JP301  2.23,21.8 270 top
L201  6.52,16 0 top
R101  27.76,11.73 0 bottom
R102  27.9,23.9 270 top
R103  26.9,23.9 270 top
R201  3.8,9.9 180 top
R202  3.5,8.89 0 top
R203  5.4,8.32 180 top
R204  8.79,10.35 90 top
R205  8.79,8.45 90 top
R301  22.66,21.72 270 top
R302  22.34,16.67 270 top
R303  17.04,26.42 270 top
R304  18.45,27.42 270 top
R305  13.37,27.02 90 top
R306  15.37,27.02 90 top
R307  22.76,26.47 270 top
R308  22.29,28.06 0 top
R309  20.01,22.5 270 bottom
R401  25.3,11.53 0 top
R402  29.96,13.18 90 top
R403  23.61,10.37 90 top
R404  22.61,10.37 90 top
R405  29.67,9.82 180 top
R406  30.17,11.28 90 top
R407  27.09,10.27 90 top
R408  28.16,8.77 90 top
R409  30.19,8.36 90 top
R410  29.67,6.78 0 top
R411  29.7,8.73 180 bottom
R412  28.95,5.97 270 bottom
R413  35.36,9.25 270 top
R414  34.85,10.7 180 top
U100  28,18 180 top
U101  18.85,11.61 90 top
U200  6.52,10.3 90 top
U300  11.75,21.79 270 top
U301  20.75,26.02 0 top
U302  20,18.07 270 bottom
U400  25.4,7.43 0 top
U401  32.25,9.85 90 top
U$2  17.3,5.3 0 top
X101  33.6,15.74 180 top

### Tracks (layer width: path | path; a pad name or v marks a point on that pad's centre or on a via)
3.3V  (via drill 0.25)
  Top 0.25: U100.9 v32.04,19.25 33.02,19.25 C103.1 | U100.48 30.75,13.89 C101.1
  Top 0.254: U100.24 24.55,21.38 C102.1 | U100.48 v31.32,14.62 31.32,15.12 U100.1 | R303.2 v17.04,25.12 v17.03,25.11 | C102.1 24.55,21.36 v23.55,21.36 | R409.2 30.19,9.8 R405.1 v30.84,9.82 | v24.11,11.68 24.26,11.53 R401.1 | v23.55,22.23 24.52,22.23 C102.1 | U101.3 21,11.94 v21.13,12.06 | v21.14,25.07 U301.4 22.63,25.07 C307.1
  Top 0.305: C307.1 22.7,23.73 C306.1 | v23.55,22.83 22.73,22.83 22.66,22.9
  Top 0.4: R301.1 v23.55,22.23 v23.55,21.36
  Top 0.406: v31.59,9.64 v31.58,9.65 v31.58,10.25 32.28,10.95 U401.4 | C306.1 22.66,23.69 22.66,22.9 R301.1
  Bottom 0.25: U302.12 19.35,14.66 19.72,14.29 | 19.72,14.29 19.72,14.3 20,14.58 U302.11 | 19.72,14.29 C310.1
  Bottom 0.254: R309.1 v20.85,23 | C310.1 v20.61,13.82 | v21.13,12.06 21.08,12.11 C107.1
  Bottom 0.406: v31.58,10.25 31.35,10.48 C409.1 C408.1
  other vias: 11.59,10.29 12.34,10.3 12.33,9.53 11.59,9.52
  pour Top (isolate 0.25, rank 2, no thermals): 7.72,11.1 9.16,11.1 9.52,11.46 9.52,11.61 9.61,11.7 10.3,11.7 10.7,12.1 12.31,12.1 12.72,11.69 12.72,9.47 12.36,9.11 9.7,9.11 9.5,9.31 9.5,10.52 7.72,10.52
  pour Route15 (rank 6, no thermals): 40,7.01 40,24.8 38.13,24.8 36.1,22.84 29.73,22.84 26.99,25.58 15.74,25.58 13.42,23.26 13.42,17.74 9.95,14.27 9.95,9.45 12.39,7.01
250_REF
  Top 0.254: R406.1 C406.1 R405.2 29.33,9.66 29.33,8.34 28.67,7.68 U400.11
250_TOFF
  Top 0.254: R407.1 26.91,9.59 26.91,8.18 | 26.91,8.18 U400.12 | 26.91,8.18 28.07,8.18 R408.1
ADDR_0
  Top 0.254: U100.19 27.75,22.35 27.9,22.5 R102.2
ADDR_1
  Top 0.254: U100.20 27.25,22.35 26.9,22.7 R103.2
AS5047_MOSI
  Bottom 0.254: U302.4 R309.2
B_IN+
  Top 0.254: C308.1 U301.1 19.6,26.92 R304.2 R303.1
B_IN-
  Top 0.254: R308.2 22.76,28.03 R307.1 | R307.1 C309.2 | R307.1 U301.5
BLDC_CURR_FDB  (via drill 0.25)
  Top 0.254: U301.3 20.35,25.07 21.25,25.97 R307.2 C309.1 27.67,25.97 30.06,23.58 35.1,23.58 35.82,22.86 v35.94,22.86 | U100.11 35.41,20.25 35.9,19.77 v35.9,19.75
  Bottom 0.254: v35.94,22.86 35.94,19.79 v35.9,19.75
BLDC_EN
  Top 0.254: U100.33 24,16.75 23.42,16.17 R302.2
BLDC_FAULT  (via drill 0.25)
  Top 0.25: R302.1 C305.1
  Top 0.254: U100.32 22.42,17.25 R302.1 | C305.1 18.23,17.17 v16.1,19.3 | v14.35,21.05 v14.34,21.04 U300.13
  Bottom 0.254: v16.1,19.3 v14.35,21.05
BLDC_INUH
  Top 0.254: U100.26 19.67,20.25 16.16,23.76 12.21,23.76 12,23.55 U300.2
BLDC_INUL  (via drill 0.25)
  Top 0.254: v17.69,19.9 17.69,19.89 18.83,18.75 U100.29 | v14.4,23.17 v14.39,23.18 U300.1
  Bottom 0.254: v17.69,19.9 14.42,23.17 v14.4,23.17
BLDC_INVH
  Top 0.254: U100.27 19.57,19.75 16.78,22.54 U300.16
BLDC_INVL  (via drill 0.25)
  Top 0.254: U100.30 18.59,18.25 v16.94,19.9 | v14.82,22.02 14.8,22.04 U300.15
  Bottom 0.254: v16.94,19.9 v14.82,22.02
BLDC_INWH
  Top 0.254: U100.28 19.07,19.25 17.92,20.4 U300.12
BLDC_INWL
  Top 0.254: U100.31 18.38,17.75 16.3,19.83 12.17,19.83 12,20 U300.11
BLDC_STBY  (via drill 0.25)
  Top 0.254: U100.25 23.31,20.75 22.84,21.22 R301.2 C304.1 19.3,21.22 16.27,24.25 v13.82,24.25 | v13.82,21.53 U300.14
  Bottom 0.254: v13.82,24.25 v13.82,21.53
BOOT  (via drill 0.25)
  Top 0.254: U100.44 28.75,13.52 v28.7,13.47 | v18.92,8.97 18.78,8.97 17.8,7.99 U$2.P$9 U$2.P$22
  Bottom 0.254: v28.7,13.47 28.35,13.47 27.26,12.38 R101.2 24.84,11.73 22.08,8.97 v18.92,8.97
CAN_H
  Top 0.254: U101.7 16.85,11.29 16.3,10.74 U$2.P$6 U$2.P$25
CAN_L
  Top 0.254: U101.6 16.8,11.94 15.8,10.94 U$2.P$5 U$2.P$26
CAN_RX
  Top 0.254: U100.41 27.25,13.76 26.1,12.6 20.16,12.6 U101.4
CAN_SILENT
  Top 0.254: U100.40 26.75,13.81 25.92,12.98 21.58,12.98 21.29,13.27 19.45,13.27 19,12.81 19,11.15 18.48,10.63 U101.8
CAN_TX
  Top 0.254: U100.42 27.74,13.7 26.25,12.2 22.47,12.2 21.97,11.71 21.97,10.96 21.65,10.63 U101.1
CLK1
  Top 0.25: 32.27,15.12 32.03,15.36 32.03,16.97 31.75,17.25 U100.5
  Top 0.254: C104.1 32.83,15.06 X101.3 32.27,15.12
CLK2
  Top 0.25: U100.6 31.69,17.75 31.69,17.74 33.12,17.74 33.53,17.32 33.53,16.68 33.84,16.36 X101.1
  Top 0.254: C105.1 34.47,16.15 34.42,16.2 X101.1
DEBUG_1
  Top 0.254: C501.DEBUG_1 36.01,22 34.82,23.19 29.17,23.19 28.25,22.28 U100.18
DEBUG_2
  Top 0.254: U100.17 28.75,22.24 29.32,22.81 34.66,22.81 37.46,20.01 38.48,20.01 arc-45 C501.DEBUG_2
GND  (via drill 0.25)
  Top 0.2: U200.10 6.52,9.82 | U200.4 7.27,9.6
  Top 0.25: U100.47 30.25,15.75 U100.EPAD | U100.36 U100.35 25.75,15.75 U100.EPAD | U100.EPAD 28.75,18.75 U100.8 31.75,18.75 32,18.5 33.97,18.5 34.14,18.67 C103.2 | U100.23 25.75,20.25 U100.EPAD
  Top 0.254: U200.4 7.32,9.1 7.52,9.1 7.8,8.82 C204.2 | U100.23 25.75,22.06 C102.2 | v9.08,21.51 v9.69,21.51 9.72,21.54 U300.7 11.5,21.54 U300.EPAD | U100.36 24.29,15.25 v24.01,14.97 | U401.2 32.25,7.86 C410.2 | v27.4,8.78 27.4,9 27.67,9.27 R408.2 C407.2 | U400.7 25.65,7.18 U400.EPAD | U400.EPAD 25.15,7.68 U400.15 25.15,9.54 v25.13,9.56 | U400.EPAD 24.65,8.18 U400.16 24.65,9.44 v24.53,9.56 | U101.2 21,11.29 v21.11,11.18 | U$2.P$1 U$2.P$30 | U$2.P$29 14.33,3.33 14.33,6.27 14.33,7.3 | U$2.P$14 U$2.P$17 | U$2.P$15 U$2.P$16
  Top 0.4: 6.52,9.82 v7.05,9.82 7.27,9.6
  Bottom 0.25: U302.13 18.72,15.18 C310.2
  Bottom 0.254: U302.5 20.65,21.98 v20.87,22.2 | R101.1 28.39,11.6 28.39,10.64 C409.2 | v21.11,11.18 21.04,11.11 C107.2
  other vias: 11.69,14.37 8.56,7.19 13,14.21 10,14 7.72,12.8 7.72,13.6 5.32,13.6 5.32,12.8 6.52,12.7 6.52,13.3 6.52,16 1.54,13.97 1.54,13.29 1.54,14.63 2.3,6.82 3.33,6.88 4.07,8.07 32.85,13.13 33,10 34.67,13.99 32.79,17.21 20.42,26.31 20.44,26.96 21.13,26.96 34.91,18.75 15.8,25 14.8,25 13.8,25 12.8,25 31,25 38,28 33,22 36.61,13.21 37,3 30,4 3,3 9.8,6.69 10.58,6.69 11.63,7.9 13.03,12.73 3,15 5.91,7.48 7.72,7.39 18.72,16.25 17.94,13.85 15.09,14.15 2,17 2,27 16.91,21.54 11.25,21.29 12.25,21.29 12.26,22.3 11.24,22.29 25.89,20.13 27.3,20.13 28.72,20.11 30.11,20.11 30.15,18.69 28.69,18.67 27.33,18.66 25.84,18.65 25.86,17.33 27.32,17.33 28.66,17.35 30.15,17.34 30.13,15.96 28.65,16.37 27.32,16.38 25.84,16.38 10.06,16.25 10.94,16.23 11.94,16.2 12.83,16.22 13.7,16.21 32.21,9.42 7,25 9,25 9,27 10,28 11,27 7,23 7,21 7,19 9,3 8,2 6,2 7,1 9,1 11,1 10,2 11,3 12,2 13,1 13,3 29,1 30,2 31,1 31,3 32,2 33,1 34,2 34,13.13 30,26 29,27 30,28 28,28 33,25 35,25 35,1 27,1 29,3 28,2 5,1 5,23 5,21 5,19 5,25 10,4 31,5 35,3 5,3 5,7 7,7 9,5 8,6 32,6 36.88,14.8 16,17 15.91,23.04 34.5,17.44 31.93,14.61 28.32,12.49 28.93,12.49 31,11.87 25.56,23.19 29,4 31,7 32,7 33,7 33,8 34.92,11.66 34,8 35,7 24.94,7.95 25.9,7.93 25.9,7.21 24.9,7.2 14.09,9.15 12.09,5.15 36.68,16.8 27,27 26,28 25,27 24,28 24.66,25.19 26.86,25.19 14,2 15,1 16,2 17,1 18,2 19,1 20,2 21,1 22,2 23,3 24,2 25,1 26,2 23,1
  pour Top (rank 6): 0,26.5 0,7.31 arc27 0.32,5.97 2.47,1.66 arc63 5.15,0 34.85,0 arc63 37.53,1.66 39.68,5.97 arc27 40,7.31 40,15.99 40,16 40,26.5 arc90 37,29.5 36,29.5 arc90 35,28.5 35,27.5 arc-90 33.5,26 arc-90 32,27.5 32,28.5 arc90 31,29.5 9,29.5 arc90 8,28.5 8,27.5 arc-90 6.5,26 arc-90 5,27.5 5,28.5 arc90 4,29.5 3,29.5 arc90
  pour Bottom (rank 6): 0,26.5 0,7.31 arc27 0.32,5.97 2.47,1.66 arc63 5.15,0 34.85,0 arc63 37.53,1.66 39.68,5.97 arc27 40,7.31 40,15.99 40,16 40,26.5 arc90 37,29.5 36,29.5 arc90 35,28.5 35,27.5 arc-90 33.5,26 arc-90 32,27.5 32,28.5 arc90 31,29.5 9,29.5 arc90 8,28.5 8,27.5 arc-90 6.5,26 arc-90 5,27.5 5,28.5 arc90 4,29.5 3,29.5 arc90
  pour Route2 (rank 6, no thermals): 0,26.5 0,7.31 arc27 0.32,5.97 2.47,1.66 arc63 5.15,0 34.85,0 arc63 37.53,1.66 39.68,5.97 arc27 40,7.31 40,15.99 40,16 40,26.5 arc90 37,29.5 36,29.5 arc90 35,28.5 35,27.5 arc-90 33.5,26 arc-90 32,27.5 32,28.5 arc90 31,29.5 9,29.5 arc90 8,28.5 8,27.5 arc-90 6.5,26 arc-90 5,27.5 5,28.5 arc90 4,29.5 3,29.5 arc90
I2C_SCL  (via drill 0.25)
  Top 0.254: v26.23,22.65 26.33,22.65 26.75,22.23 U100.21 | v18.13,9.83 16.8,8.5 U$2.P$7 U$2.P$24
  Bottom 0.254: v26.23,22.65 25.76,22.65 23.13,20.02 23.13,13.35 21.59,11.81 21.59,10.98 20.44,9.83 v18.13,9.83
I2C_SDA  (via drill 0.25)
  Top 0.254: U100.22 26.25,22.05 v26.23,22.07 | v18.47,9.35 17.3,8.17 U$2.P$8 17.3,5.4 | 17.3,5.4 U$2.P$23 | 17.3,5.4
  Bottom 0.254: v26.23,22.07 25.72,22.07 23.51,19.86 23.51,13.17 21.97,11.64 21.97,10.82 20.6,9.45 18.57,9.45 v18.47,9.35
M_IN+
  Top 0.254: U401.1 C410.1 31.25,7.86 R409.1 30.17,7.84 R410.2
M_IN-
  Top 0.254: U401.5 31.3,11.34 31.46,11.5 34.02,11.5 34.35,11.17 R414.2 C411.2 R413.1
M_PH
  Top 0.254: R403.1 23.61,9.33 24.01,8.93 U400.1
M_PWM
  Top 0.254: R404.1 22.61,8.57 23.5,7.68 U400.2
MAG_CURR_FDB  (via drill 0.25)
  Top 0.254: U401.3 C411.1 R413.2 35.85,8.75 36.07,8.97 36.07,11.45 v35.82,11.7 | v35.83,18.93 35.01,19.75 U100.10
  Bottom 0.254: v35.82,11.7 v35.82,18.92 v35.83,18.93
MAG_DIR  (via drill 0.25)
  Top 0.254: R403.2 23.53,10.95 v23.53,11.68 | v25.21,13.46 25.83,13.46 26.25,13.88 U100.39
  Bottom 0.254: v23.53,11.68 23.63,11.78 23.63,11.88 v25.21,13.46
MAG_EN
  Top 0.2: 29.75,13.89 R402.2
  Top 0.254: U100.46 29.75,13.89
MAG_FAULT  (via drill 0.25)
  Top 0.254: 29.25,12.98 29.25,13 v29.25,13.68 U100.45 | R402.1 29.51,12.68 29.25,12.94 29.25,12.98 | 29.25,12.98 28.12,12.98 26.43,11.29 26.43,9.95 26.15,9.67 U400.13
  Bottom 0.254: v29.25,13.68 C405.1
MAG_PWM  (via drill 0.25)
  Top 0.254: U100.38 25.75,14.21 25.48,13.94 24.92,13.94 24.45,13.47 v24.45,13.46 | v22.63,11.61 22.63,10.89 R404.2
  Bottom 0.254: v24.45,13.46 22.63,11.64 v22.63,11.61
MAG_STBY
  Top 0.254: U100.43 28.25,13.66 26.13,11.54 25.8,11.54 R401.2 C404.1 25.65,10.38 U400.14
NRST
  Top 0.25: U100.7 31.72,18.25 31.85,18.12 36,18.12 36.35,18.12 37.5,16.97 37.5,15.59 38.5,14.58 C501.NRST
  Top 0.254: C106.1 35.85,18.12 36,18.12
OUT1  (via drill 0.25)
  Top 0.254: U400.10 v27.54,7.18 | U400.3 23.6,7.18 23.32,6.9 v23.32,6.58 | U$2.P$10 v18.3,6.43 U$2.P$21
  Bottom 0.254: v27.54,7.18 27.33,7.18 26.73,6.58 v23.32,6.58
  Bottom 0.406: v23.32,6.58 22.86,7.04 18.91,7.04 v18.3,6.43
OUT2  (via drill 0.25)
  Top 0.254: U400.5 v24.65,5.35 | U400.8 v26.15,5.35 | U$2.P$11 v18.8,6.09 U$2.P$20
  Bottom 0.254: v24.65,5.35
  Bottom 0.4: v24.65,5.35 v26.15,5.35
  Bottom 0.406: v24.65,5.35 23.67,5.35 22.52,6.5 19.21,6.5 v18.8,6.09
SENSE_BLDC  (via drill 0.25)
  Top 0.254: U300.9 v10.31,20.4 | U300.4 10.97,23.15 v10.32,23.15 | R306.2 R304.1
  Top 0.45: v10.33,24.32 10.33,27.22 11.03,27.92 R305.2 R306.2
  Bottom 0.254: v10.32,23.15 v10.32,20.41 v10.31,20.4
  Bottom 0.45: v10.32,23.15 v10.32,24.31 v10.33,24.32
SENSE_MAG  (via drill 0.25)
  Top 0.254: U400.9 27.41,6.68 v27.49,6.6 27.5,6.59 27.82,6.59 28.01,6.78 R410.1 | U400.4 23.95,6.62 v23.95,6.09
  Bottom 0.254: v23.95,6.09 26.98,6.09 v27.49,6.6
  Bottom 0.406: v27.49,6.6 28.68,6.6 R412.1 28.95,8.58 R411.1
SPI1_CS  (via drill 0.25)
  Top 0.25: v30.25,22.01 U100.14
  Bottom 0.25: U302.1 18.05,23.08 19.54,24.57 28.25,24.57 30.25,22.57 v30.25,22.01
SPI1_MISO  (via drill 0.25)
  Top 0.25: v29.25,22.01 U100.16
  Bottom 0.25: U302.3 19.35,23.32 19.84,23.81 27.78,23.81 29.25,22.34 v29.25,22.01
SPI1_SCK  (via drill 0.25)
  Top 0.25: v29.75,22.32 U100.15
  Bottom 0.25: U302.2 18.7,23.2 19.7,24.2 27.94,24.2 29.75,22.39 v29.75,22.32
SWCLK  (via drill 0.25)
  Top 0.25: U100.37 24.64,14.62 v24.62,14.65
  Top 0.254: C501.SWCLK 36.23,12.27 31.6,12.27 v30.91,12.95
  Bottom 0.25: v24.62,14.65 25.36,15.39 29.31,15.39 30.91,13.79 v30.91,12.95
SWDIO  (via drill 0.25)
  Top 0.25: U100.34 24.25,16.25 v24,16 v23.99,16
  Top 0.254: C501.SWDIO 37.09,12 36.44,12.65 31.9,12.65 v31.59,12.96
  Bottom 0.25: v23.99,16 24.23,15.77 29.48,15.77 31.59,13.66 v31.59,12.96
TOFF1
  Top 0.254: R407.2 27.08,11.19 27.34,11.45 C407.1
TPS-EN2
  Top 0.2: R201.1 4.3,10.07 U200.14 5.54,10.07 5.77,9.85 U200.1
  Top 0.254: R201.1 4.15,9.75 4.15,8.89 R202.2
TPS-FB2
  Top 0.2: U200.5 8.79,9.57 R205.2
  Top 0.5: R205.2 8.78,9.84 R204.1
TPS-L5  (via drill 0.25)
  Bottom 0.8: v4.32,11.9 v5.52,11.9
  Bottom 1: v4.32,11.9 v4.32,17.3
  other vias: 4.92,11.9 4.32,14.7 4.32,15.6 4.32,16.4
  pour Top (no thermals): 6.12,10.4 6.12,12.2 4.02,12.2 4.02,11.5 5.52,11.5 5.82,11.2 5.82,10.4
  pour Top (no thermals): 5.72,17.6 5.72,14.4 3.62,14.4 3.62,17.6
TPS-L6  (via drill 0.25)
  Bottom 0.8: v8.72,11.9 v7.52,11.9
  Bottom 1: v8.72,11.9 v8.72,14.7 v8.72,17.3
  other vias: 8.12,11.9 8.72,16.4 8.72,15.6
  pour Top (no thermals): 6.92,10.4 6.92,12.2 9.02,12.2 9.02,11.5 7.52,11.5 7.22,11.2 7.22,10.4
  pour Top (no thermals): 7.32,14.4 7.32,17.6 9.42,17.6 9.42,14.4
TPS-VAUX2
  Top 0.2: U200.3 6.77,8.35
  Top 0.254: 6.77,8.35 C204.1
TPS-VSEL2
  Top 0.254: U200.15 5.12,9.22 4.9,9 R203.2
U
  Top 0.254: U300.3 11.49,23.6 11.29,23.8 JP301.1
UART_RX
  Top 0.25: U100.13 35.56,21.38 38.19,18.74
  Top 0.254: 38.19,18.74 arc-45 C501.UART_RX
UART_TX
  Top 0.25: U100.12 35.65,20.75 37.5,18.9 37.5,17.59 38.5,16.58 C501.UART_TX
V
  Top 0.254: U300.8 10.35,21.03 8.06,21.03 7.29,21.8 JP301.2
VBUS  (via drill 0.25)
  Top 0.254: U300.6 9.75,22.04 v9.69,22.1 | U400.6 25.15,4.61 C403.1
  Top 0.406: C401.1 C402.1 C403.1 v24.16,4.53 v24.15,4.54 v23.52,4.54
  Top 0.5: C203.1 3.3,10.91 R201.2
  Top 0.6: C301.1 C302.1 C303.1 v9.53,18.93 v8.98,18.93
  other vias: 9.08,22.11 9.37,22.61 0.81,11.94 1.42,11.38 0.84,10.98 1.39,10.45 0.85,10.02 14.81,4.18 15.26,4.59 14.82,4.99 15.27,5.39 14.81,5.79 15.28,6.24 19.8,4.17 19.34,4.59 19.78,5.02 19.32,5.49 19.79,5.9
  pour Top (isolate 0.25, rank 2, no thermals): 5.32,11.06 4.04,11.06 3.52,11.56 2.74,11.56 2.4,11.9 2.4,12.12 2.22,12.3 0.55,12.3 0.55,9.55 3.5,9.55 3.6,9.65 3.6,10.14 3.92,10.46 5.32,10.46
  pour Top: 10,21.97 10,22.26 9.5,22.76 9.2,22.76 8.88,22.44 8.88,22.04 8.95,21.97
  pour Route15 (no thermals): 39.98,6.56 37.53,1.66 arc-63 34.85,0 5.15,0 arc-63 2.47,1.66 0.32,5.97 arc-27 0,7.31 0,26.5 arc-90 3,29.5 4,29.5 arc-90 5,28.5 5,27.5 arc90 6.5,26 arc90 8,27.5 8,28.5 arc-90 9,29.5 31,29.5 arc-90 32,28.5 32,27.5 arc90 33.5,26 arc90 35,27.5 35,28.5 arc-90 36,29.5 37,29.5 arc-90 40,26.5 40,25.2 37.9,25.2 35.9,23.2 30,23.2 27.2,26 15.5,26 13,23.5 13,18 9.5,14.5 9.5,9.3 12.24,6.56
  pour Bottom (isolate 0.25): 3.58,12.25 3.58,9.74 3.44,9.6 0.59,9.6 0.59,12.25
  pour Top (no thermals): 14.65,7.8 15.45,7.8 15.45,2.8 14.65,2.8
  pour Top (no thermals): 19.15,7.8 19.95,7.8 19.95,2.8 19.15,2.8
W
  Top 0.254: JP301.3 11.29,19.8 11.49,20 U300.10

### Text on the board
tPlace: ACS Driver / OreSat / Rev 4.2B / Eric Ruhl
bPlace: ACS Driver / OreSat / Rev 4.2B / Eric Ruhl